# Altium schematic sheet RTC_Module.SchDoc
size A; SheetNumber: 5; SheetTotal: 6
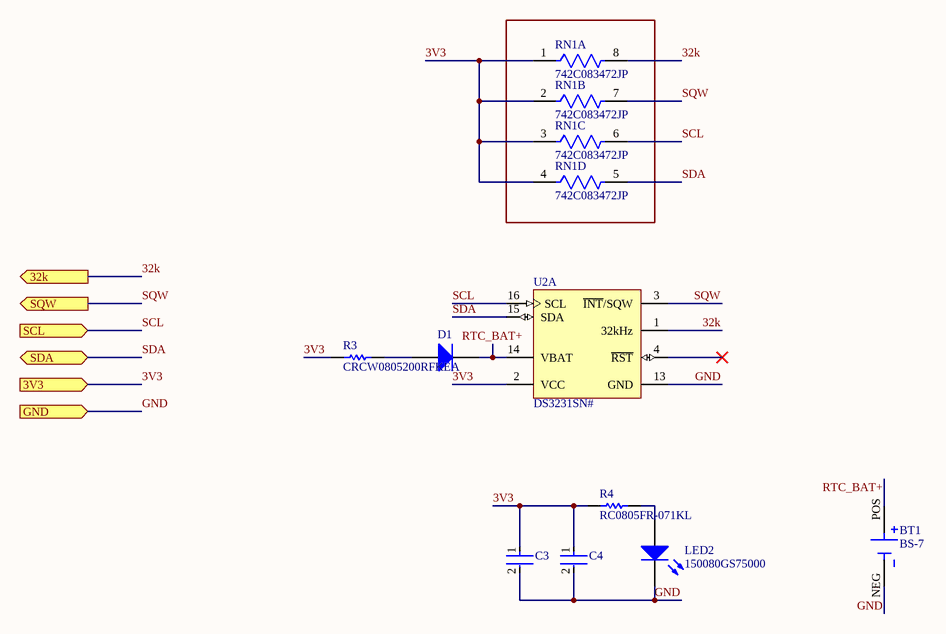
[diagram p0: RTC_Module.SchDoc]

## Parts
BT1  BS-7  [BAT_BS-7]
C3  C0805C104K5RACTU  [FP-C0805C-DN-MFG]  (value not drawn)
C4  C0805C104K5RACTU  [FP-C0805C-DN-MFG]  (value not drawn)
D1  1N4148W-7-F  [DIOD-SOD123-2_V]  (value not drawn)
LED2  150080GS75000  [0805_A]
R3  CRCW0805200RFKEA  [RESC2013X50X30NL20T20]
R4  RC0805FR-071KL  [RESC2013X60X35ML10T20]
RN1  742C083472JP  [FP-742C083-MFG]  (parts A,B,C,D of 4)
U2  DS3231SN#  [W16#H2_M]  (part A of 2)

## Ports
3V3 (in), 32k (out), GND (in), SCL (in), SDA (bidir), SQW (out)

## Nets
3V3: C3.1 C4.1 R3.2 R4.2 RN1.1 RN1.2 RN1.3 RN1.4 U2.2(VCC) ; port 3V3
32k: RN1.8 U2.1(32kHz) ; port 32k
GND: BT1.NEG C3.2 C4.2 LED2.1(K) U2.13(GND) ; port GND
RTC_BAT+: BT1.POS D1.2(K) U2.14(VBAT)
SCL: RN1.6 U2.16(SCL) ; port SCL
SDA: RN1.5 U2.15(SDA) ; port SDA
SQW: RN1.7 U2.3(~{INT}/SQW) ; port SQW
NetD1_1: D1.1(A) R3.1
NetLED2_2: LED2.2(A) R4.1

Not connected (* = marked no-connect by the designer): U2 4(~{RST})*

## Library data of the parts
BT1 = BS-7: BATTERY HOLDER COIN 20MM PC PIN; MF: MPD _Memory; Value: *; SnapEDA_Link: https://www.snapeda.com/parts/BS-7/MPD%20%28Memory%20Protection%20Devices%29/view-part/4219629/?ref=snap; MP: BS-7; Availability: Unavailable; Price: None; Package: None
C3 C4 = CMP-2007-00279-2: CAP CER 0.1UF 50V X7R 0805; Manufacturer: KEMET; Value: 0.10 μF; Tolerance: 0.1; Temperature Coefficient: 30ppm/°C; Material: Ceramic; Manufacturer Part Number: C0805C104K5RACTU; Device Class L2: Capacitors; Temperature Range Low: -55°C; Voltage Rating: 50 V; Digikey Description: CAP CER 0.1UF 50V X7R 0805; Category: Cap; ComponentLink2Description: Datasheet; Octopart: https://octopart.com/c0805c104k5ractu-kemet-143926; RoHS: TRUE; ComponentLink2URL: https://content.kemet.com/datasheets/KEM_C1003_C0G_SMD.pdf; Temperature Characteristic: X7R; Temperature: -55°C to +125°C; Height: 0.88mm; Temperature Range High: +125°C; Device Class L1: Passive Components; Automotive: No; Lead Free: Yes; Ipc Land Pattern Name: CAPC200125X78; Device Class L3: Ceramic Capacitors; Mouser Description: Cap Ceramic 0.1uF 50V X7R 10% SMD 2.0 x 1.2 mm 125 C Paper T/R; Capacitance: 0.10 μF; Package: C0805C-DN
D1 = CMP-2000-04932-2: Fast Switching Diode, 100 V, 0.15 A, -65 to 150 degC, 2-Pin?SOD123, RoHS, Tape and Reel; Recovery Time: 4ns; Brand: DiodesIncorporated; Unit Weight: 0.000353oz; Max Surge Current: 2A; Peak Reverse Voltage: 100V; Ir - Reverse Current: 1uA; Vf - Forward Voltage: 1.25V; Configuration: Single; If - Forward Current: 0.15A; Product Category: Diodes-GeneralPurpose,Power,Switching; Operating Temperature Range: -65Cto+150C; Packaging: Reel; Manufacturer URL: http://www.diodes.com/; Maximum Operating Temperature: +150C; Height: 1.25mm; Minimum Operating Temperature: -65C; Product: SwitchingDiodes; Package URL: http://www.diodes.com/datasheets/ds18004.pdf; Type: SwitchingDiode; Package Reference: SOD123-2; Width: 1.7mm; Datasheet URL: http://www.farnell.com/datasheets/1915529.pdf; Datasheet Version: Rev. 24-2, 10/2013; Series: 1N4148; Factory Pack Quantity: 3000; Length: 2.85mm; RoHS: True; Manufacturer: DiodesIncorporated; Mounting Style: SMD/SMT; Package / Case: SOD-123
LED2 = CMP-1426-00007-1: SMD mono-color Chip LED, WL-SMCW, Green; Manufacturer: Wuerth Elektronik; PackageReference: 0805_A; Color: Green; PartNumber: 150080GS75000; ComponentLink2URL: http://katalog.we-online.com/led/datasheet/150080GS75000.pdf; ComponentLink1URL: http://www.we-online.com; ComponentLink1Description: Manufacturer URL; ComponentLink2Description: Datasheet
R3 = CMP-2001-03663-1: Manufacturer: Vishay Dale; Part Number: CRCW0805200RFKEA
R4 = CMP-2100-03671-1: Chip Resistor, 1 KOhm, +/- 1%, 125 mW, -55 to 155 degC, 0805 (2012 Metric), RoHS, Tape and Reel; Manufacturer: Yageo; Temperature Coefficient: 100ppm/degreesC; Voltage Rating (DC): 150V; Max Power Dissipation: 125mW; Resistance: 1KOhm; Number of Pins: 2; Number of Terminations: 2; Datasheet URL: http://www.yageo.com/NewPortal/yageodocoutput?fileName=/pdf/R-Chip/PYu-RC_Group_51_RoHS_L_5.pdf; Length: 0.079inch; Package Description: 2-Pin Surface Mounted Device, Body 2 x 1.25 mm; Depth: 1.25mm; Height: 0.024inch; Military Standard: Not; Case/Package: 0805; Package Reference: 0805; RoHSCompliant: true; Lead Free: LeadFree; Packaging: TapeandReel; Package Quantity: 1; Datasheet Version: Rev. 5, 10/2016; Tolerance: 1%; Min Operating Temperature: -55degC; Voltage Rating: 150V; Composition: ThickFilm; Case Code (Imperial): 0805; Power Rating: 125mW; Width: 0.049inch; Case Code (Metric): 2012; Manufacturer URL: http://www.yageo.com/; Max Operating Temperature: 155degC; REACH SVHC: Unknown; Termination: SMD/SMT
RN1 = CMP-06828-000002-1: RES ARRAY 4 RES 4.7K OHM 1206; Tolerance: 5%; Resistance: 4.7kR; Power Per Element: 62.5mW; Number of Resistors: 4; Power Rating: 250mW; Power Dissipation: 63mW; Working Voltage: 50V; Circuit Type: Isolated; Temperature Coefficient: 200ppm/°C; Depth: 1.6mm; Max Operating Temperature: 125°C; Contact Plating: Tin; Width: 0.063inch; Packaging: Tape and Reel; Termination: Concave; Length: 3.2mm; Case Code (Imperial): 1206; Case Code (Metric): 3216; Case/Package: Molded; Military Standard: Not; Mount: Surface Mount; Number of Elements: 4; Package Quantity: 1; Min Operating Temperature: -55°C; Number of Pins: 8; Radiation Hardening: No; Terminal Pitch: 0.8mm; Height: 0.028inch; Number of Terminals: 8; Lead Free: Lead Free
U2 = CMP-0254-00293-2: Extremely Accurate I2C-Integrated Real-Time Clock/TCXO/Crystal, 16-Pin SO, -40 to 85 degC, RoHS Qualified; Code_IPC: SOIC127P1030-16; ComponentLink2URL: http://datasheets.maxim-ic.com/en/ds/DS3231.pdf; Code_JEDEC: MS-013-AA; ComponentLink1URL: http://www.maxim-ic.com; ComponentLink2Description: Datasheet; ComponentLink3Description: Package Specification; DatasheetVersion: Rev 8, Jul-2010; PackageVersion: revD, 2010; ComponentLink1Description: Manufacturer URL; PackageDescription: 16-Pin Small-Outline IC, Wide (0.3in), 1.27 mm Pitch, SOIC (W), RoHS Qualified; ComponentLink3URL: http://pdfserv.maxim-ic.com/package_dwgs/21-0042.PDF; PackageReference: W16#H2